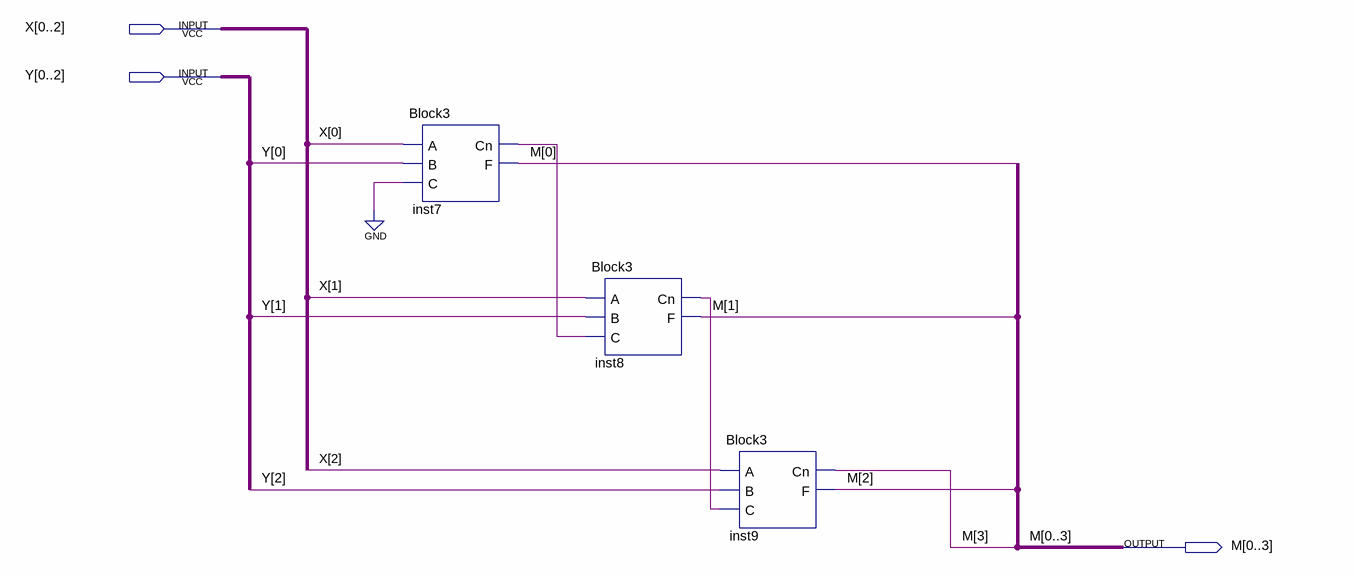
[diagram p0: schematic sheet]
// Quartus schematic Block4.bdf as structural Verilog: 3 symbols, 3 pins
module Block4 (
  input  [0:2] X,
  input  [0:2] Y,
  output [0:3] M
);

  wire inst7_cn, inst8_cn;

  Block3 inst7 (.A(X[0]), .B(Y[0]), .C(1'b0), .Cn(inst7_cn), .F(M[0]));
  Block3 inst8 (.A(X[1]), .B(Y[1]), .C(inst7_cn), .Cn(inst8_cn), .F(M[1]));
  Block3 inst9 (.A(X[2]), .B(Y[2]), .C(inst8_cn), .Cn(M[3]), .F(M[2]));
endmodule
